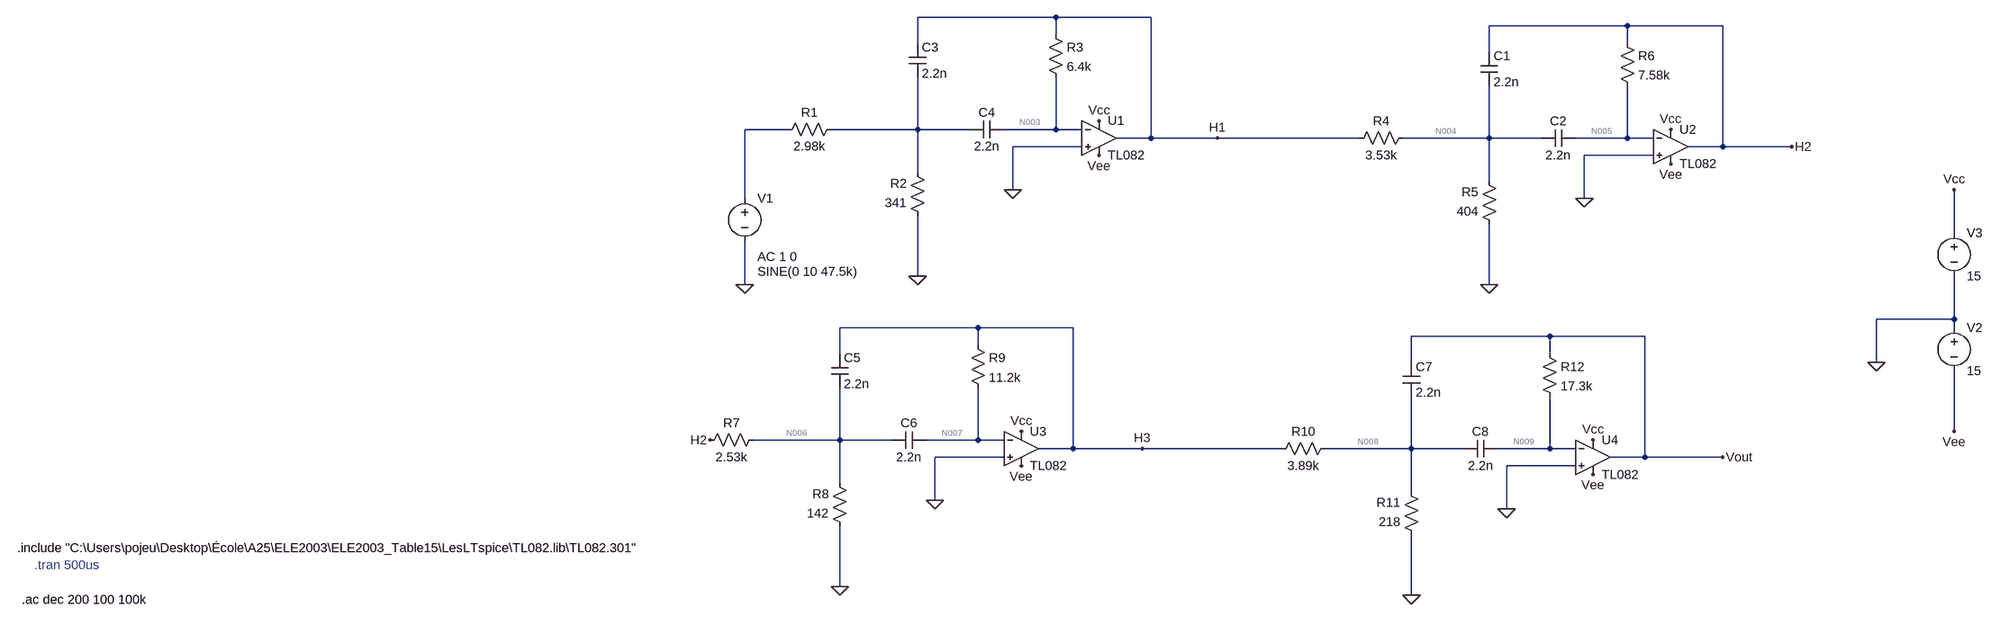
[diagram p0: schematic Filtres assembles_2.asc]
Filtres assembles_2.asc, the LTspice schematic file:
Version 4.1
SHEET 1 4064 1060
WIRE -288 -400 -544 -400
WIRE -112 -400 -288 -400
WIRE 800 -384 544 -384
WIRE 976 -384 800 -384
WIRE -288 -368 -288 -400
WIRE -544 -352 -544 -400
WIRE 800 -352 800 -384
WIRE 544 -336 544 -384
WIRE -784 -192 -864 -192
WIRE -544 -192 -544 -288
WIRE -544 -192 -704 -192
WIRE -448 -192 -544 -192
WIRE -288 -192 -288 -288
WIRE -288 -192 -384 -192
WIRE -240 -192 -288 -192
WIRE -112 -176 -112 -400
WIRE -112 -176 -176 -176
WIRE 16 -176 -112 -176
WIRE 304 -176 16 -176
WIRE 544 -176 544 -272
WIRE 544 -176 384 -176
WIRE 640 -176 544 -176
WIRE 800 -176 800 -272
WIRE 800 -176 704 -176
WIRE 848 -176 800 -176
WIRE -240 -160 -368 -160
WIRE 976 -160 976 -384
WIRE 976 -160 912 -160
WIRE 1104 -160 976 -160
WIRE 848 -144 720 -144
WIRE -544 -112 -544 -192
WIRE 544 -96 544 -176
WIRE -368 -80 -368 -160
WIRE -864 -64 -864 -192
WIRE 720 -64 720 -144
WIRE 1536 0 1536 -80
WIRE -544 80 -544 -32
WIRE -864 96 -864 16
WIRE 544 96 544 -16
WIRE 1536 160 1536 80
WIRE 1536 160 1392 160
WIRE -432 176 -688 176
WIRE -256 176 -432 176
WIRE 1536 176 1536 160
WIRE 656 192 400 192
WIRE 832 192 656 192
WIRE -432 208 -432 176
WIRE -688 224 -688 176
WIRE 656 224 656 192
WIRE 400 240 400 192
WIRE 1392 240 1392 160
WIRE 1536 368 1536 256
WIRE -688 384 -688 288
WIRE -688 384 -848 384
WIRE -592 384 -688 384
WIRE -432 384 -432 288
WIRE -432 384 -528 384
WIRE -384 384 -432 384
WIRE -256 400 -256 176
WIRE -256 400 -320 400
WIRE -128 400 -256 400
WIRE 160 400 -128 400
WIRE 400 400 400 304
WIRE 400 400 240 400
WIRE 496 400 400 400
WIRE 656 400 656 304
WIRE 656 400 560 400
WIRE 704 400 656 400
WIRE -384 416 -512 416
WIRE 832 416 832 192
WIRE 832 416 768 416
WIRE 976 416 832 416
WIRE 704 432 576 432
WIRE -688 464 -688 384
WIRE 400 480 400 400
WIRE -512 496 -512 416
WIRE 576 512 576 432
WIRE -688 656 -688 544
WIRE 400 672 400 560
FLAG -544 80 0
FLAG -864 96 0
FLAG 1392 240 0
FLAG 1536 -80 Vcc
FLAG 1536 368 Vee
FLAG -208 -208 Vcc
FLAG -208 -144 Vee
FLAG -368 -80 0
FLAG 544 96 0
FLAG 880 -192 Vcc
FLAG 880 -128 Vee
FLAG 720 -64 0
FLAG -688 656 0
FLAG -352 368 Vcc
FLAG -352 432 Vee
FLAG -512 496 0
FLAG 400 672 0
FLAG 736 384 Vcc
FLAG 736 448 Vee
FLAG 576 512 0
FLAG 16 -176 H1
FLAG 1104 -160 H2
FLAG -128 400 H3
FLAG 976 416 Vout
FLAG -928 384 H2
SYMBOL res -688 -208 R90
WINDOW 0 0 56 VBottom 2
WINDOW 3 32 56 VTop 2
SYMATTR InstName R1
SYMATTR Value 2.98k
SYMBOL res -528 -16 R180
WINDOW 0 36 76 Left 2
WINDOW 3 36 40 Left 2
SYMATTR InstName R2
SYMATTR Value 341
SYMBOL cap -560 -352 R0
SYMATTR InstName C3
SYMATTR Value 2.2n
SYMBOL cap -384 -208 R90
WINDOW 0 0 32 VBottom 2
WINDOW 3 32 32 VTop 2
SYMATTR InstName C4
SYMATTR Value 2.2n
SYMBOL res -304 -384 R0
SYMATTR InstName R3
SYMATTR Value 6.4k
SYMBOL voltage -864 -80 R0
WINDOW 123 24 124 Left 2
WINDOW 39 0 0 Left 0
WINDOW 3 24 152 Left 2
SYMATTR Value2 AC 1 0
SYMATTR InstName V1
SYMATTR Value SINE(0 10 47.5k)
SYMBOL voltage 1536 160 R0
SYMATTR InstName V2
SYMATTR Value 15
SYMBOL voltage 1536 -16 R0
SYMATTR InstName V3
SYMATTR Value 15
SYMBOL OpAmps\\opamp2 -208 -240 R0
SYMATTR InstName U1
SYMATTR Value TL082
SYMBOL res 400 -192 R90
WINDOW 0 0 56 VBottom 2
WINDOW 3 32 56 VTop 2
SYMATTR InstName R4
SYMATTR Value 3.53k
SYMBOL res 560 0 R180
WINDOW 0 36 76 Left 2
WINDOW 3 36 40 Left 2
SYMATTR InstName R5
SYMATTR Value 404
SYMBOL cap 528 -336 R0
SYMATTR InstName C1
SYMATTR Value 2.2n
SYMBOL cap 704 -192 R90
WINDOW 0 0 32 VBottom 2
WINDOW 3 32 32 VTop 2
SYMATTR InstName C2
SYMATTR Value 2.2n
SYMBOL res 784 -368 R0
SYMATTR InstName R6
SYMATTR Value 7.58k
SYMBOL OpAmps\\opamp2 880 -224 R0
SYMATTR InstName U2
SYMATTR Value TL082
SYMBOL res -832 368 R90
WINDOW 0 0 56 VBottom 2
WINDOW 3 32 56 VTop 2
SYMATTR InstName R7
SYMATTR Value 2.53k
SYMBOL res -672 560 R180
WINDOW 0 36 76 Left 2
WINDOW 3 36 40 Left 2
SYMATTR InstName R8
SYMATTR Value 142
SYMBOL cap -704 224 R0
SYMATTR InstName C5
SYMATTR Value 2.2n
SYMBOL cap -528 368 R90
WINDOW 0 0 32 VBottom 2
WINDOW 3 32 32 VTop 2
SYMATTR InstName C6
SYMATTR Value 2.2n
SYMBOL res -448 192 R0
SYMATTR InstName R9
SYMATTR Value 11.2k
SYMBOL OpAmps\\opamp2 -352 336 R0
SYMATTR InstName U3
SYMATTR Value TL082
SYMBOL res 256 384 R90
WINDOW 0 0 56 VBottom 2
WINDOW 3 32 56 VTop 2
SYMATTR InstName R10
SYMATTR Value 3.89k
SYMBOL res 416 576 R180
WINDOW 0 36 76 Left 2
WINDOW 3 36 40 Left 2
SYMATTR InstName R11
SYMATTR Value 218
SYMBOL cap 384 240 R0
SYMATTR InstName C7
SYMATTR Value 2.2n
SYMBOL cap 560 384 R90
WINDOW 0 0 32 VBottom 2
WINDOW 3 32 32 VTop 2
SYMATTR InstName C8
SYMATTR Value 2.2n
SYMBOL res 640 208 R0
SYMATTR InstName R12
SYMATTR Value 17.3k
SYMBOL OpAmps\\opamp2 736 352 R0
SYMATTR InstName U4
SYMATTR Value TL082
TEXT -2352 584 Left 2 !.include "C:\\Users\\pojeu\\Desktop\\École\\A25\\ELE2003\\ELE2003_Table15\\LesLTspice\\TL082.lib\\TL082.301"
TEXT -2344 680 Left 2 !.ac dec 200 100 100k
TEXT -2320 616 Left 2 ;.tran 500us

The netlist it stands for:
* Filtres assembles_2.asc
R1 N002 N001 2.98k
R2 0 N002 341
C3 H1 N002 2.2n
C4 N003 N002 2.2n
R3 H1 N003 6.4k
V1 N001 0 SINE(0 10 47.5k) AC 1 0
V2 0 Vee 15
V3 Vcc 0 15
X§U1 0 N003 Vcc Vee H1 TL082  ; pins In+ In- V+ V- OUT
R4 N004 H1 3.53k
R5 0 N004 404
C1 H2 N004 2.2n
C2 N005 N004 2.2n
R6 H2 N005 7.58k
X§U2 0 N005 Vcc Vee H2 TL082  ; pins In+ In- V+ V- OUT
R7 N006 H2 2.53k
R8 0 N006 142
C5 H3 N006 2.2n
C6 N007 N006 2.2n
R9 H3 N007 11.2k
X§U3 0 N007 Vcc Vee H3 TL082  ; pins In+ In- V+ V- OUT
R10 N008 H3 3.89k
R11 0 N008 218
C7 Vout N008 2.2n
C8 N009 N008 2.2n
R12 Vout N009 17.3k
X§U4 0 N009 Vcc Vee Vout TL082  ; pins In+ In- V+ V- OUT
.include "C:\Users\pojeu\Desktop\École\A25\ELE2003\ELE2003_Table15\LesLTspice\TL082.lib\TL082.301"
.ac dec 200 100 100k
* .tran 500us
.backanno
.end

* Results of the author's LTspice run, read from the files saved beside the schematic
* Operating Point, zero values left out:
*   V(n003) = 10.97 µV
*   V(vee) = -15 V
*   V(n004) = 1.156 µV
*   V(n006) = 601.2 nV
*   V(n007) = 10.97 µV
*   V(n008) = 609 nV
*   V(n009) = 10.97 µV
*   V(h1) = 11.26 µV
*   V(vcc) = 15 V
*   V(h2) = 11.31 µV
*   V(n005) = 10.97 µV
*   V(h3) = 11.48 µV
*   V(vout) = 11.75 µV
*   I(R3) = 45.05 pA
*   I(R4) = -2.862 nA
*   I(R8) = -4.234 nA
*   I(R9) = 45.05 pA
*   I(R10) = -2.793 nA
*   I(V3) = -56.78 mA
*   I(R5) = -2.862 nA
*   I(R6) = 45.05 pA
*   I(R7) = -4.234 nA
*   I(R11) = -2.793 nA
*   I(R12) = 45.05 pA
*   I(V2) = -56.78 mA
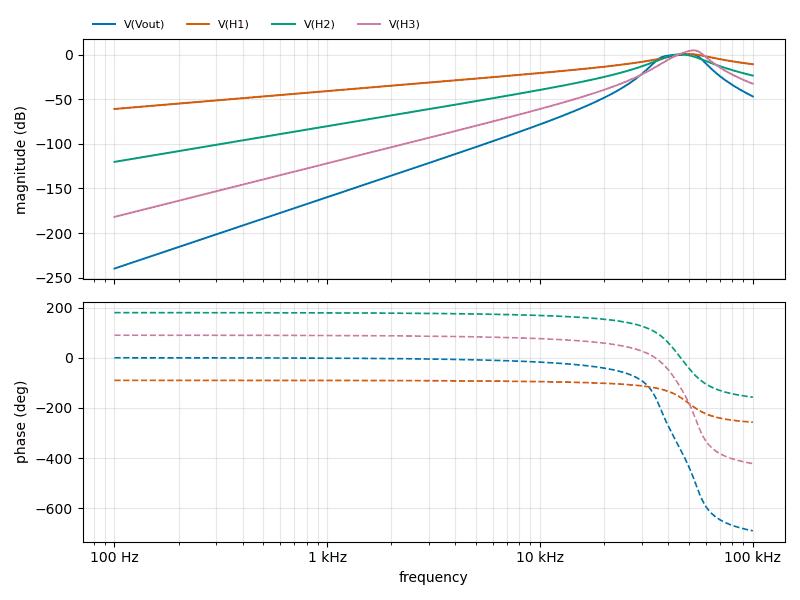
[diagram p1: AC Analysis of Filtres assembles_2.asc, plotted from the saved traces]
* AC Analysis, 1 run:
*   V(Vout): -239.82 dB at 100 Hz, -46.75 dB at 100 kHz, peak 0.92 dB at 50.12 kHz, 3 dB below the peak at 37.95 kHz and 55.54 kHz
*   V(H1): -60.83 dB at 100 Hz, -10.68 dB at 100 kHz, peak 0.76 dB at 50.12 kHz, 3 dB below the peak at 40.62 kHz and 61.39 kHz
*   V(H2): -120.20 dB at 100 Hz, -23.40 dB at 100 kHz, peak 0.24 dB at 46.24 kHz, 3 dB below the peak at 39.28 kHz and 53.93 kHz
*   V(H3): -181.89 dB at 100 Hz, -32.56 dB at 100 kHz, peak 4.93 dB at 52.48 kHz, 3 dB below the peak at 46.64 kHz and 56.99 kHz